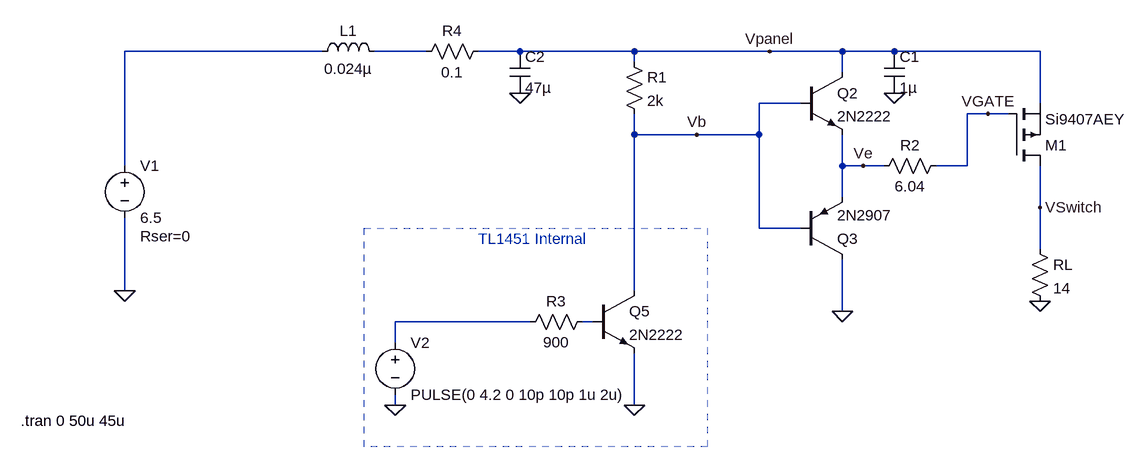
[diagram p0: schematic MOSFET-Drive.asc]
MOSFET-Drive.asc, the LTspice schematic file:
Version 4
SHEET 1 1592 772
WIRE 272 -16 -32 -16
WIRE 432 -16 352 -16
WIRE 576 -16 512 -16
WIRE 752 -16 576 -16
WIRE 960 -16 752 -16
WIRE 1072 -16 960 -16
WIRE 1152 -16 1072 -16
WIRE 1376 -16 1152 -16
WIRE 752 0 752 -16
WIRE 1072 16 1072 -16
WIRE 1008 64 944 64
WIRE 1376 64 1376 -16
WIRE 1296 80 1264 80
WIRE 1328 80 1296 80
WIRE 752 112 752 80
WIRE 848 112 752 112
WIRE 944 112 944 64
WIRE 944 112 848 112
WIRE -32 160 -32 -16
WIRE 1072 160 1072 112
WIRE 1104 160 1072 160
WIRE 1136 160 1104 160
WIRE 1264 160 1264 80
WIRE 1264 160 1216 160
WIRE 1072 208 1072 160
WIRE 1376 224 1376 160
WIRE 944 256 944 112
WIRE 1008 256 944 256
WIRE 1376 288 1376 224
WIRE -32 352 -32 240
WIRE 752 352 752 112
WIRE 1072 384 1072 304
WIRE 592 400 384 400
WIRE 688 400 672 400
WIRE 384 432 384 400
WIRE 384 528 384 512
WIRE 752 528 752 448
FLAG -32 352 0
FLAG 1376 368 0
FLAG 1072 384 0
FLAG 752 528 0
FLAG 384 528 0
FLAG 1296 80 VGATE
FLAG 1376 224 VSwitch
FLAG 960 -16 Vpanel
FLAG 1104 160 Ve
FLAG 848 112 Vb
FLAG 1152 48 0
FLAG 576 48 0
SYMBOL voltage -32 144 R0
WINDOW 123 0 0 Left 2
WINDOW 39 24 124 Left 2
SYMATTR SpiceLine Rser=0
SYMATTR InstName V1
SYMATTR Value 6.5
SYMBOL res 1360 272 R0
SYMATTR InstName RL
SYMATTR Value 14
SYMBOL npn 1008 16 R0
SYMATTR InstName Q2
SYMATTR Value 2N2222
SYMBOL pnp 1008 304 M180
SYMATTR InstName Q3
SYMATTR Value 2N2907
SYMBOL pmos 1328 160 M180
SYMATTR InstName M1
SYMATTR Value Si9407AEY
SYMBOL res 688 384 R90
WINDOW 0 0 56 VBottom 2
WINDOW 3 32 56 VTop 2
SYMATTR InstName R3
SYMATTR Value 900
SYMBOL npn 688 352 R0
SYMATTR InstName Q5
SYMATTR Value 2N2222
SYMBOL res 736 -16 R0
SYMATTR InstName R1
SYMATTR Value 2k
SYMBOL voltage 384 416 R0
WINDOW 123 0 0 Left 2
WINDOW 39 0 0 Left 2
SYMATTR InstName V2
SYMATTR Value PULSE(0 4.2 0 10p 10p 1u 2u)
SYMBOL res 1232 144 R90
WINDOW 0 0 56 VBottom 2
WINDOW 3 32 56 VTop 2
SYMATTR InstName R2
SYMATTR Value 6.04
SYMBOL cap 1136 -16 R0
SYMATTR InstName C1
SYMATTR Value 1µ
SYMATTR SpiceLine Rser=0.005
SYMBOL res 528 -32 R90
WINDOW 0 0 56 VBottom 2
WINDOW 3 32 56 VTop 2
SYMATTR InstName R4
SYMATTR Value 0.1
SYMBOL ind 256 0 R270
WINDOW 0 32 56 VTop 2
WINDOW 3 5 56 VBottom 2
SYMATTR InstName L1
SYMATTR Value 0.024µ
SYMBOL cap 560 -16 R0
SYMATTR InstName C2
SYMATTR Value 47µ
SYMATTR SpiceLine Rser=0.005
TEXT -192 552 Left 2 !.tran 0 50u 45u
TEXT 512 272 Left 2 ;TL1451 Internal
RECTANGLE Normal 864 592 336 256 2

The netlist it stands for:
* MOSFET-Drive.asc
V1 N001 0 6.5 Rser=0
RL VSwitch 0 14
Q2 Vpanel Vb Ve 0 2N2222
Q3 0 Vb Ve 0 2N2907
M1 VSwitch VGATE Vpanel Vpanel Si9407AEY
R3 N004 N003 900
Q5 Vb N004 0 0 2N2222
R1 Vpanel Vb 2k
V2 N003 0 PULSE(0 4.2 0 10p 10p 1u 2u)
R2 VGATE Ve 6.04
C1 Vpanel 0 1µ Rser=0.005
R4 Vpanel N002 0.1
L1 N001 N002 0.024µ
C2 Vpanel 0 47µ Rser=0.005
.model NPN NPN
.model PNP PNP
.lib standard.bjt
.model NMOS NMOS
.model PMOS PMOS
.lib standard.mos
.tran 0 50u 45u
* TL1451 Internal
.backanno
.end